# Altium schematic sheet [04] - POWER HARVESTING SYSTEM.SchDoc
size A2; DocumentNumber: 4; SheetNumber: 4; SheetTotal: 12
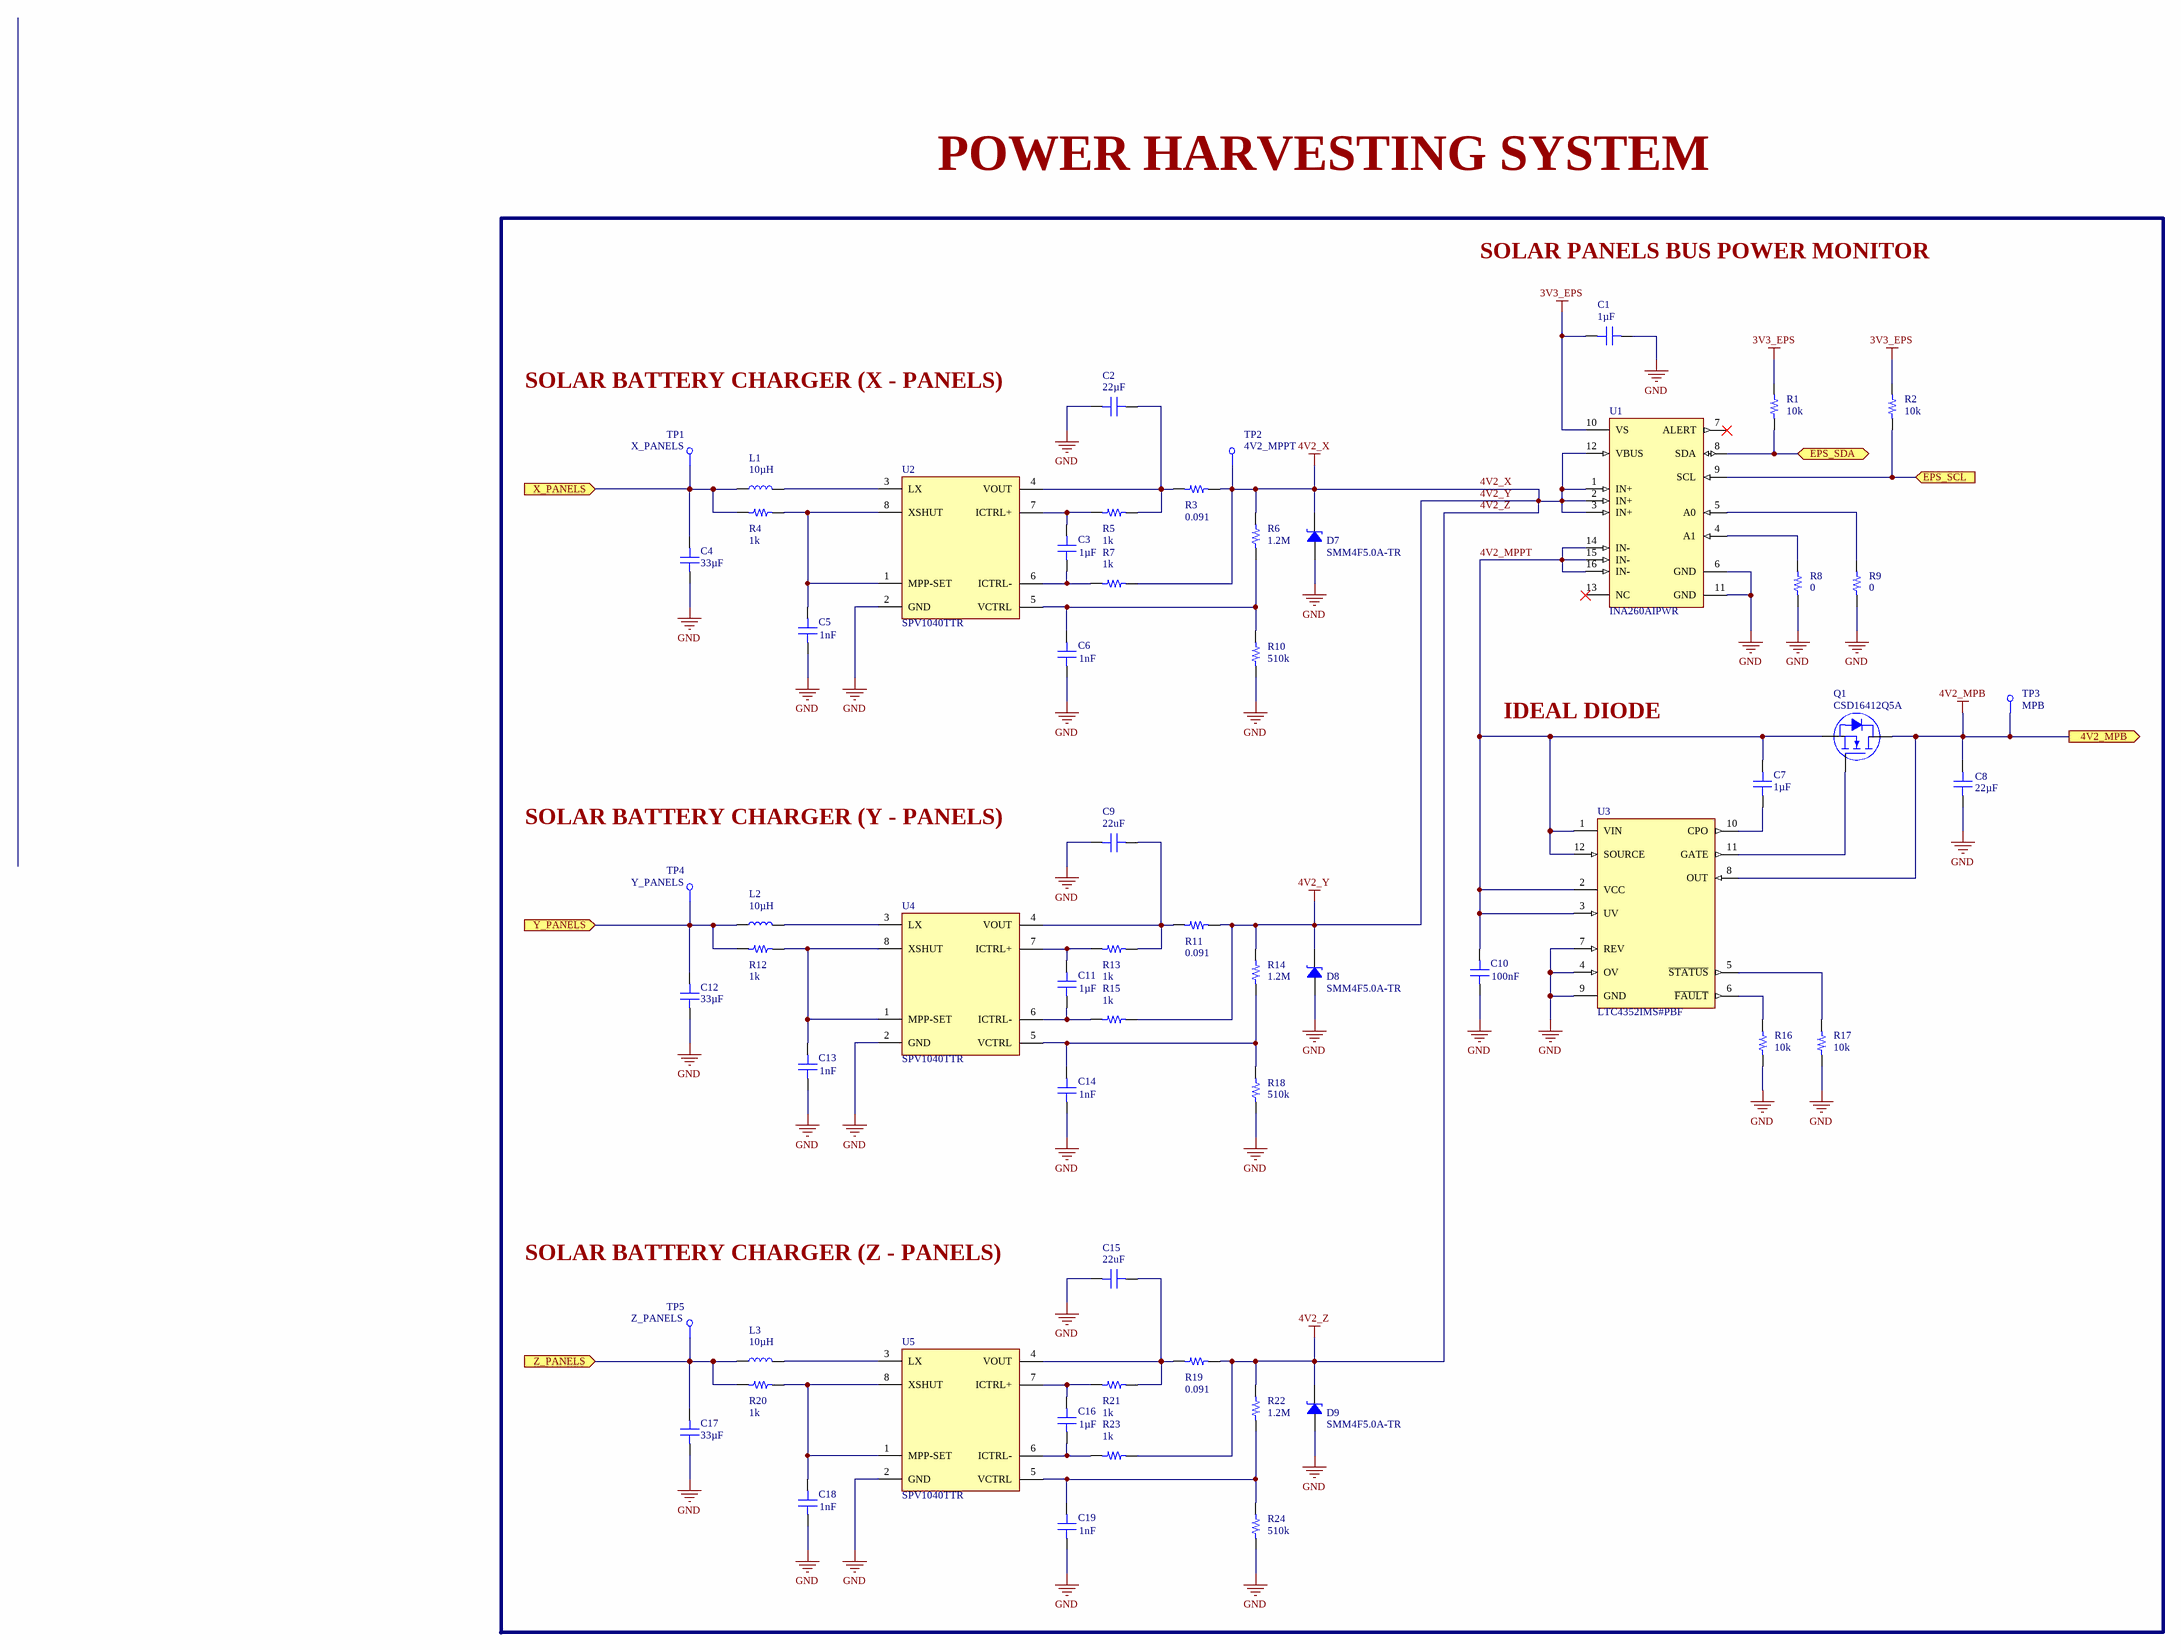
[diagram p0: [04] - POWER HARVESTING SYSTEM.SchDoc]

## Parts
C1  Capacitance: 1µF  [CAP 0603/1608]  (hidden comment: CL10A105KP8NNNC)
C2  Capacitance: 22µF  [CAP 0805/2012]  (hidden comment: CL21A226MQQNNNE)
C3  Capacitance: 1µF  [CAP 0603/1608]  (hidden comment: CL10A105KP8NNNC)
C4  Capacitance: 33µF  [CAP 0805/2012]  (hidden comment: GRM21BR60G336ME15L)
C5  Capacitance: 1nF  [CAP 0603/1608]  (hidden comment: CL10C102JB8NNNC)
C6  Capacitance: 1nF  [CAP 0603/1608]  (hidden comment: CL10C102JB8NNNC)
C7  Capacitance: 1µF  [CAP 0603/1608]  (hidden comment: CL10A105KP8NNNC)
C8  Capacitance: 22µF  [CAP 0603/1608]  (hidden comment: GRM188R60J226MEA0D)
C9  Capacitance: 22uF  [CAP 0805/2012]  (hidden comment: CL21A226MQQNNNE)
C10  Capacitance: 100nF  [CAP 0603/1608]  (hidden comment: C0603C104K8RACTU)
C11  Capacitance: 1µF  [CAP 0603/1608]  (hidden comment: CL10A105KP8NNNC)
C12  Capacitance: 33µF  [CAP 0805/2012]  (hidden comment: GRM21BR60G336ME15L)
C13  Capacitance: 1nF  [CAP 0603/1608]  (hidden comment: CL10C102JB8NNNC)
C14  Capacitance: 1nF  [CAP 0603/1608]  (hidden comment: CL10C102JB8NNNC)
C15  Capacitance: 22uF  [CAP 0805/2012]  (hidden comment: CL21A226MQQNNNE)
C16  Capacitance: 1µF  [CAP 0603/1608]  (hidden comment: CL10A105KP8NNNC)
C17  Capacitance: 33µF  [CAP 0805/2012]  (hidden comment: GRM21BR60G336ME15L)
C18  Capacitance: 1nF  [CAP 0603/1608]  (hidden comment: CL10C102JB8NNNC)
C19  Capacitance: 1nF  [CAP 0603/1608]  (hidden comment: CL10C102JB8NNNC)
D7  SMM4F5.0A-TR  [DO216-AA]
D8  SMM4F5.0A-TR  [DO216-AA]
D9  SMM4F5.0A-TR  [DO216-AA]
L1  Inductance: 10µH  [SRR1206]  (hidden comment: SRR1206-100ML)
L2  Inductance: 10µH  [SRR1206]  (hidden comment: SRR1206-100ML)
L3  Inductance: 10µH  [SRR1206]  (hidden comment: SRR1206-100ML)
Q1  CSD16412Q5A  [8-VSONP (5x6)]
R1  Resistance: 10k  [RES 0603/1608]  (hidden comment: RNCP0603FTD10K0)
R2  Resistance: 10k  [RES 0603/1608]  (hidden comment: RNCP0603FTD10K0)
R3  Resistance: 0.091  [STACKPOLE CSRN2512]  (hidden comment: RLP73N3AR091FTDF)
R4  Resistance: 1k  [RES 0603/1608]  (hidden comment: ESR03EZPJ102)
R5  Resistance: 1k  [RES 0603/1608]  (hidden comment: ESR03EZPJ102)
R6  Resistance: 1.2M  [RES 0603/1608]  (hidden comment: RC0603JR-071M2L)
R7  Resistance: 1k  [RES 0603/1608]  (hidden comment: ESR03EZPJ102)
R8  Resistance: 0  [RES 0603/1608]  (hidden comment: RMCF0603ZT0R00)
R9  Resistance: 0  [RES 0603/1608]  (hidden comment: RMCF0603ZT0R00)
R10  Resistance: 510k  [RES 0603/1608]  (hidden comment: RMCF0603FT510K)
R11  Resistance: 0.091  [STACKPOLE CSRN2512]  (hidden comment: RLP73N3AR091FTDF)
R12  Resistance: 1k  [RES 0603/1608]  (hidden comment: ESR03EZPJ102)
R13  Resistance: 1k  [RES 0603/1608]  (hidden comment: ESR03EZPJ102)
R14  Resistance: 1.2M  [RES 0603/1608]  (hidden comment: RC0603JR-071M2L)
R15  Resistance: 1k  [RES 0603/1608]  (hidden comment: ESR03EZPJ102)
R16  Resistance: 10k  [RES 0603/1608]  (hidden comment: RNCP0603FTD10K0)
R17  Resistance: 10k  [RES 0603/1608]  (hidden comment: RNCP0603FTD10K0)
R18  Resistance: 510k  [RES 0603/1608]  (hidden comment: RMCF0603FT510K)
R19  Resistance: 0.091  [STACKPOLE CSRN2512]  (hidden comment: RLP73N3AR091FTDF)
R20  Resistance: 1k  [RES 0603/1608]  (hidden comment: ESR03EZPJ102)
R21  Resistance: 1k  [RES 0603/1608]  (hidden comment: ESR03EZPJ102)
R22  Resistance: 1.2M  [RES 0603/1608]  (hidden comment: RC0603JR-071M2L)
R23  Resistance: 1k  [RES 0603/1608]  (hidden comment: ESR03EZPJ102)
R24  Resistance: 510k  [RES 0603/1608]  (hidden comment: RMCF0603FT510K)
TP1  X_PANELS  [Testpoint]
TP2  4V2_MPPT  [Testpoint]
TP3  MPB  [Testpoint]
TP4  Y_PANELS  [Testpoint]
TP5  Z_PANELS  [Testpoint]
U1  INA260AIPWR  [TSOP65P640X120-16N]
U2  SPV1040TTR  [TSOP65P630X120-8N]
U3  LTC4352IMS#PBF  [MSOP-12]
U4  SPV1040TTR  [TSOP65P630X120-8N]
U5  SPV1040TTR  [TSOP65P630X120-8N]

## Ports
4V2_MPB (out), EPS_SCL (in), EPS_SDA (bidir), X_PANELS (in), Y_PANELS (in), Z_PANELS (in)

## Nets
3V3_EPS: C1.1 R1.2 R2.2 U1.10(VS)
4V2_MPB: C8.2 Q1.D TP3.1 U3.8(OUT) ; port 4V2_MPB
4V2_X: D7.K D8.K D9.K R3.2 R6.2 R7.2 R11.2 R14.2 R15.2 R19.2 R22.2 R23.2 TP2.1 U1.1(IN+) U1.2(IN+) U1.3(IN+) U1.12(VBUS)  [also labelled 4V2_Y, 4V2_Z]
GND: C1.2 C2.2 C4.1 C5.1 C6.1 C8.1 C9.2 C10.1 C12.1 C13.1 C14.1 C15.2 C17.1 C18.1 C19.1 D7.A D8.A D9.A R8.1 R9.1 R10.1 R16.1 R17.1 R18.1 R24.1 U1.6(GND) U1.11(GND) U2.2(GND) U3.4(OV) U3.7(REV) U3.9(GND) U4.2(GND) U5.2(GND)
4V2_MPPT: C7.2 C10.2 Q1.S U1.14(IN-) U1.15(IN-) U1.16(IN-) U3.1(VIN) U3.2(VCC) U3.3(UV) U3.12(SOURCE)
EPS_SCL: R2.1 U1.9(SCL) ; port EPS_SCL
EPS_SDA: R1.1 U1.8(SDA) ; port EPS_SDA
X_PANELS: C4.2 L1.1 R4.1 TP1.1 ; port X_PANELS
Y_PANELS: C12.2 L2.1 R12.1 TP4.1 ; port Y_PANELS
Z_PANELS: C17.2 L3.1 R20.1 TP5.1 ; port Z_PANELS
NetC2_1: C2.1 R3.1 R5.2 U2.4(VOUT)
NetC3_1: C3.1 R7.1 U2.6(ICTRL-)
NetC3_2: C3.2 R5.1 U2.7(ICTRL+)
NetC5_2: C5.2 R4.2 U2.1(MPP-SET) U2.8(XSHUT)
NetC6_2: C6.2 R6.1 R10.2 U2.5(VCTRL)
NetC7_1: C7.1 U3.10(CPO)
NetC9_1: C9.1 R11.1 R13.2 U4.4(VOUT)
NetC11_1: C11.1 R15.1 U4.6(ICTRL-)
NetC11_2: C11.2 R13.1 U4.7(ICTRL+)
NetC13_2: C13.2 R12.2 U4.1(MPP-SET) U4.8(XSHUT)
NetC14_2: C14.2 R14.1 R18.2 U4.5(VCTRL)
NetC15_1: C15.1 R19.1 R21.2 U5.4(VOUT)
NetC16_1: C16.1 R23.1 U5.6(ICTRL-)
NetC16_2: C16.2 R21.1 U5.7(ICTRL+)
NetC18_2: C18.2 R20.2 U5.1(MPP-SET) U5.8(XSHUT)
NetC19_2: C19.2 R22.1 R24.2 U5.5(VCTRL)
NetL1_2: L1.2 U2.3(LX)
NetL2_2: L2.2 U4.3(LX)
NetL3_2: L3.2 U5.3(LX)
NetQ1_G: Q1.G U3.11(GATE)
NetR8_2: R8.2 U1.4(A1)
NetR9_2: R9.2 U1.5(A0)
NetR16_2: R16.2 U3.6(~{FAULT})
NetR17_2: R17.2 U3.5(~{STATUS})

Not connected (* = marked no-connect by the designer): U1 7(ALERT)* 13(NC)*

## Notes on the sheet
- POWER HARVESTING SYSTEM
- SOLAR PANELS BUS POWER MONITOR
- SOLAR BATTERY CHARGER (X - PANELS)
- IDEAL DIODE
- SOLAR BATTERY CHARGER (Y - PANELS)
- SOLAR BATTERY CHARGER (Z - PANELS)
- Project:
- Page Contents:
- Size:
- Revision:
- A2
- Document Number:
- Design:
- Date:
- Sheet
- of

## Library data of the parts
C1 C3 C7 C11 C16 = CL10A105KP8NNNC: CAP CER 1UF 10V X5R 0603; Manufacturer: Samsung; Tolerance: 10%; Supplier 1: Digi-Key; Manufacturer Part Number: CL10A105KP8NNNC; Stock 1: 4411775; Pricing 1: 1 = 0.10000, 10 = 0.03800, 100 = 0.01680, 500 = 0.01200, 1000 = 0.00943 (USD); RoHS: Yes; Mount: Surface Mount; Case/Package: 0603; Case Code (Metric): 1608; Case Code (Imperial): 0603; Contact Plating: Tin; Min Operating Temperature: -55°C; Max Operating Temperature: 85°C; Packaging: Tape and Reel; Package Quantity: 1; Voltage Rating: 10V; Dielectric: X5R; Voltage: 10V; Length: 1.6mm; Height: 0.8mm; Width: 0.031inch; Thickness: 0.035inch; Depth: 0.8mm; Radiation Hardening: No; ComponentLink1URL: https://datasheet.ciiva.com/15195/getdatasheetpartid-358616-15195708.pdf?src-supplier=Verical; ComponentLink1Description: https://datasheet.ciiva.com/15195/getdatasheetpartid-358616-15195708.pdf?src-supplier=Verical; ComponentLink2URL: https://datasheet.ciiva.com/16358/cl05b104kq5nnnc-16358431.pdf?src-supplier=Future+Electronics; ComponentLink2Description: https://datasheet.ciiva.com/16358/cl05b104kq5nnnc-16358431.pdf?src-supplier=Future+Electronics; Supplier Part Number 1: 1276-1182-1-ND
C2 C9 C15 = CL21A226MQQNNNE: CAP CER 22UF 6.3V X5R 0805; Manufacturer: Samsung; Tolerance: 20%; Supplier 1: Digi-Key; Manufacturer Part Number: CL21A226MQQNNNE; Stock 1: 20000; Pricing 1: 1=0.22, 10=0.152, 100=0.0768, 500=0.05256, 1000=0.04649 (USD); Mount: Surface Mount; Case/Package: 0805; Contact Plating: Tin; Case Code (Metric): 2012; Case Code (Imperial): 0805; Min Operating Temperature: -55°C; Max Operating Temperature: 85°C; Package Quantity: 2000; Packaging: Tape and Reel; Voltage Rating: 6.3V; Dielectric: X5R; Voltage Rating (DC): 6.3V; Length: 2mm; Height: 1.25mm; Width: 0.049inch; Thickness: 0.055inch; Depth: 1.25mm; Radiation Hardening: No; Lead Free: Lead Free; ComponentLink1URL: https://datasheet.ciiva.com/25796/cl21a226mqqnnne-25796195.pdf; ComponentLink1Description: https://datasheet.ciiva.com/25796/cl21a226mqqnnne-25796195.pdf; ComponentLink2URL: https://datasheet.ciiva.com/26838/getdatasheetpartid-357607-26838611.pdf; ComponentLink2Description: https://datasheet.ciiva.com/26838/getdatasheetpartid-357607-26838611.pdf; ComponentLink3URL: https://datasheet.ciiva.com/16361/cl21a226mqqnnne-16361189.pdf; ComponentLink3Description: https://datasheet.ciiva.com/16361/cl21a226mqqnnne-16361189.pdf; ComponentLink4URL: https://datasheet.ciiva.com/26787/cl21a226mqqnnne-26787006.pdf; ComponentLink4Description: https://datasheet.ciiva.com/26787/cl21a226mqqnnne-26787006.pdf; Supplier Part Number 1: 1276-1100-6-ND
C4 C12 C17 = GRM21BR60G336ME15L: CAP CER 33UF 4V X5R 0805; Manufacturer: Murata; Tolerance: 20%; Supplier 1: Digi-Key; Manufacturer Part Number: GRM21BR60G336ME15L; Stock 1: 3473; Pricing 1: 1=0.92, 10=0.699, 100=0.5, 500=0.3871, 1000=0.33333 (USD); Case/Package: 0805; Min Operating Temperature: -55°C; Max Operating Temperature: 125°C; Packaging: Tape and Reel; Dielectric: X5R; Voltage Rating (DC): 4V; Length: 2mm; Depth: 1.25mm; Width: 1.25mm; Thickness: 1.25mm; Supplier Part Number 1: 490-16621-1-ND
C5 C6 C13 C14 C18 C19 = CL10C102JB8NNNC: CAP CER 1000PF 50V C0G/NP0 0603; Manufacturer: Samsung; Material: Ceramic; Tolerance: 5%; Dielectric: C0G; Temperature Coefficient: 300ppm/°C; Supplier 1: Digi-Key; Manufacturer Part Number: CL10C102JB8NNNC; Stock 1: 2851554; Pricing 1: 1=0.1, 10=0.057, 100=0.0253, 500=0.0181, 1000=0.01422 (USD); Mount: Surface Mount; Case/Package: 0603; Case Code (Metric): 1608; Case Code (Imperial): 0603; Min Operating Temperature: -55°C; Max Operating Temperature: 125°C; Packaging: Tape and Reel; Package Quantity: 1; Voltage Rating: 50V; Voltage: 50V; Voltage Rating (DC): 50V; Length: 1.6mm; Height: 0.8mm; Depth: 0.8mm; Width: 0.031inch; Thickness: 0.035inch; Radiation Hardening: No; Lead Free: Lead Free; ComponentLink1URL: https://www.distrelec.biz/Web/Downloads/_e/ng/MLCC_CatalogDownload2013_ENG.pdf?mime=application%2Fpdf&src-supplier=Distrelec; ComponentLink1Description: https://www.distrelec.biz/Web/Downloads/_e/ng/MLCC_CatalogDownload2013_ENG.pdf?mime=application%2Fpdf&src-supplier=Distrelec; ComponentLink2URL: https://www.verical.com/server-webapp/html/getDatasheet?partID=354056&src-supplier=Verical; ComponentLink2Description: https://www.verical.com/server-webapp/html/getDatasheet?partID=354056&src-supplier=Verical; ComponentLink3URL: https://produktinfo.conrad.com/datenblaetter/450000-474999/458273-da-01-en-VS_KONDENSATOR_0603.pdf?src-supplier=Conrad; ComponentLink3Description: https://produktinfo.conrad.com/datenblaetter/450000-474999/458273-da-01-en-VS_KONDENSATOR_0603.pdf?src-supplier=Conrad; Supplier Part Number 1: 1276-1091-1-ND
C8 = GRM188R60J226MEA0D: CAP CER 22UF 6.3V X5R 0603; Manufacturer: Murata; Tolerance: 20%; Supplier 1: Digi-Key; Manufacturer Part Number: GRM188R60J226MEA0D; Stock 1: 6592419; Pricing 1: 1 = 0.26000, 10 = 0.17700, 100 = 0.10010, 500 = 0.07066, 1000 = 0.06182 (USD); RoHS: Yes; Mount: Surface Mount; Case/Package: 0603; Weight: 0.000222oz; Case Code (Metric): 1608; Case Code (Imperial): 0603; Min Operating Temperature: -55°C; Max Operating Temperature: 85°C; Packaging: Tape and Reel; Package Quantity: 4000; Voltage Rating: 6.3V; Dielectric: X5R; Termination: SMD/SMT; Voltage Rating (DC): 6.3V; Length: 1.6mm; Height: 0.8mm; Width: 0.8mm; Thickness: 0.039inch; Depth: 0.8mm; REACH SVHC: No SVHC; Lead Free: Lead Free; ComponentLink1URL: https://datasheet.ciiva.com/29540/partnumbering-e-01-29540441.pdf?src-supplier=Digi-Key; ComponentLink1Description: https://datasheet.ciiva.com/29540/partnumbering-e-01-29540441.pdf?src-supplier=Digi-Key; ComponentLink2URL: https://datasheet.ciiva.com/29540/partnumbering-e-01-29540442.pdf?src-supplier=Digi-Key; ComponentLink2Description: https://datasheet.ciiva.com/29540/partnumbering-e-01-29540442.pdf?src-supplier=Digi-Key; ComponentLink3URL: https://datasheet.ciiva.com/29540/partnumbering-e-01-29540443.pdf?src-supplier=Digi-Key; ComponentLink3Description: https://datasheet.ciiva.com/29540/partnumbering-e-01-29540443.pdf?src-supplier=Digi-Key; Supplier Part Number 1: 490-7611-1-ND
C10 = C0603C104K8RACTU: CAP CER 0.1UF 10V X7R 0603; Manufacturer: KEMET; Dielectric Material: Ceramic; Tolerance: 10%; Dissipation Factor: 5%; Supplier 1: Digi-Key; Manufacturer Part Number: C0603C104K8RACTU; Stock 1: 778651; Pricing 1: 1=0.15, 10=0.107, 100=0.0504, 500=0.03536, 1000=0.02927 (USD); Mount: Surface Mount,PCB; Case/Package: 0603; Number of Pins: 2; Case Code (Imperial): 0603; Case Code (Metric): 1608; Contact Plating: Tin,Matte; Min Operating Temperature: -55°C; Max Operating Temperature: 125°C; Voltage Rating: 10V; Packaging: Tape and Reel; Package Quantity: 1; Voltage Rating (DC): 10V; Dielectric: X7R; Termination: SMD/SMT; Voltage: 10V; Length: 1.6mm; Height: 0.8mm; Width: 0.8mm; Lead Pitch: 0.7mm; Thickness: 0.034inch; Depth: 0.8mm; Radiation Hardening: No; REACH SVHC: No SVHC; ComponentLink1URL: http://www.farnell.com/datasheets/2315110.pdf?src-supplier=Farnell; ComponentLink1Description: http://www.farnell.com/datasheets/2315110.pdf?src-supplier=Farnell; ComponentLink2URL: http://www.kemet.com/kemet/web/homepage/kechome.nsf/vapubfiles/KEM_C1002_X7R_SMD.pdf/$file/KEM_C1002_X7R_SMD.pdf?src-supplier=Element14; ComponentLink2Description: http://www.kemet.com/kemet/web/homepage/kechome.nsf/vapubfiles/KEM_C1002_X7R_SMD.pdf/$file/KEM_C1002_X7R_SMD.pdf?src-supplier=Element14; ComponentLink3URL: https://www.verical.com/server-webapp/html/getDatasheet?partID=91529&src-supplier=Verical; ComponentLink3Description: https://www.verical.com/server-webapp/html/getDatasheet?partID=91529&src-supplier=Verical; ComponentLink4URL: http://www.mouser.com/ds/2/212/KEM_C1002_X7R_SMD-1102033.pdf?src-supplier=Mouser; ComponentLink4Description: http://www.mouser.com/ds/2/212/KEM_C1002_X7R_SMD-1102033.pdf?src-supplier=Mouser; ComponentLink5URL: http://www.alliedelec.com/m/d/9bfe7773041ffe9d406e68bc7b377fdd.pdf?src-supplier=Allied+Electronics; ComponentLink5Description: http://www.alliedelec.com/m/d/9bfe7773041ffe9d406e68bc7b377fdd.pdf?src-supplier=Allied+Electronics; ComponentLink6URL: http://www.farnell.com/datasheets/1851736.pdf?src-supplier=Element14; ComponentLink6Description: http://www.farnell.com/datasheets/1851736.pdf?src-supplier=Element14; Supplier Part Number 1: 399-1095-1-ND
D7-D9 = SMM4F5.0A-TR: Diode TVS Single Uni-Dir 5V 400W 2-Pin DO-222AA T/R; Manufacturer: STMicroelectronics; Direction: Unidirectional; Reverse Breakdown Voltage: 6.46V; Max Surge Current: 174A; Number of Channels: 1; Clamping Voltage: 13.4V; Power Line Protection: No; Test Current: 10mA; Max Reverse Leakage Current: 10uA; Supplier 1: Digi-Key; Manufacturer Part Number: SMM4F5.0A-TR; Stock 1: 10565; Pricing 1: 1=0.6, 10=0.511, 100=0.3816, 500=0.2998, 1000=0.23166 (USD); Mount: Surface Mount; Number of Pins: 2; Min Operating Temperature: -55°C; Max Operating Temperature: 175°C; Packaging: Tape and Reel; Operating Supply Voltage: 5V; Package Quantity: 12000; Polarity: Unidirectional; Breakdown Voltage: 6.46V; Peak Pulse Power: 400W; Termination: SMD/SMT; Number of Unidirectional Channels: 1; Reverse Standoff Voltage: 5V; Min Breakdown Voltage: 6.46V; Number of Elements: 1; Peak Pulse Current: 174A; Element Configuration: Single; Max Power Dissipation: 400W; Leakage Current: 10uA; Composition: Zener; Radiation Hardening: No; ComponentLink1URL: http://www.mouser.com/ds/2/389/CD00178940-251527.pdf?src-supplier=Mouser; ComponentLink1Description: http://www.mouser.com/ds/2/389/CD00178940-251527.pdf?src-supplier=Mouser; ComponentLink2URL: http://www.st.com/web/en/resource/technical/document/datasheet/CD00178940.pdf?src-supplier=Digi-Key; ComponentLink2Description: http://www.st.com/web/en/resource/technical/document/datasheet/CD00178940.pdf?src-supplier=Digi-Key; ComponentLink3URL: http://www.st.com/web/en/resource/technical/document/datasheet/CD00178940.pdf?src-supplier=Avnet+Europe; ComponentLink3Description: http://www.st.com/web/en/resource/technical/document/datasheet/CD00178940.pdf?src-supplier=Avnet+Europe; Supplier Part Number 1: 497-15660-1-ND
L1-L3 = SRR1206-100ML: FIXED IND 10UH 3.3A 35 MOHM SMD; Manufacturer: Bourns; Core Material: Ferrite; Material: Steel; Q Factor: 18; Self Resonant Frequency: 18MHz; Shielding: Shielded; Tolerance: 20%; Saturation Current: 5.7A; Resistance: 35MR; Test Frequency: 1kHz; Supplier 1: Digi-Key; Manufacturer Part Number: SRR1206-100ML; Stock 1: 4095; Pricing 1: 1=1.13, 10=1.047, 100=0.7567 (USD); Mount: Surface Mount; Case/Package: Nonstandard; Number of Pins: 12; Min Operating Temperature: -40°C; Max Operating Temperature: 125°C; Packaging: Tape and Reel; Inductance Tolerance: 20%; Package Quantity: 600; Current Rating: 3.3A; Frequency: 18MHz; Composition: Wirewound; DC Resistance (DCR): 35mR; Max DC Current: 3.3A; Termination: SMD/SMT; DC Current: 3.3A; Military Standard: Not; RMS Current (Irms): 3.3A; Length: 12.7mm; Height: 6.5mm; Width: 12.7mm; Height - Seated (Max): 0.256inch; Depth: 13mm; Radiation Hardening: No; REACH SVHC: No SVHC; ComponentLink1URL: http://www.bourns.com/pdfs/SRR1206.pdf?src-supplier=Avnet+Europe; ComponentLink1Description: http://www.bourns.com/pdfs/SRR1206.pdf?src-supplier=Avnet+Europe; ComponentLink2URL: http://www.bourns.com/docs/Product-Datasheets/SRR1206.pdf?src-supplier=Digi-Key; ComponentLink2Description: http://www.bourns.com/docs/Product-Datasheets/SRR1206.pdf?src-supplier=Digi-Key; ComponentLink3URL: https://www.bourns.com/docs/Product-Datasheets/SRR1206.pdf?src-supplier=Digi-Key; ComponentLink3Description: https://www.bourns.com/docs/Product-Datasheets/SRR1206.pdf?src-supplier=Digi-Key; ComponentLink4URL: http://www.bourns.com/pdfs/SRR1206.pdf?src-supplier=Avnet; ComponentLink4Description: http://www.bourns.com/pdfs/SRR1206.pdf?src-supplier=Avnet; ComponentLink5URL: http://www.farnell.com/datasheets/1914018.pdf?src-supplier=Element14; ComponentLink5Description: http://www.farnell.com/datasheets/1914018.pdf?src-supplier=Element14; Supplier Part Number 1: SRR1206-100MLCT-ND
Q1 = CSD16412Q5A: MOSFET N-CH 25V 52A 8SON; Manufacturer: Texas Instruments; Rds On Max: 11mR; Input Capacitance: 530pF; Rise Time: 7.1ns; Nominal Vgs: 2V; Max Power Dissipation: 3W; Fall Time: 3.3ns; Drain to Source Resistance: 9mR; Turn-Off Delay Time: 5.7ns; Gate to Source Voltage (Vgs): 16V; Turn-On Delay Time: 5.5ns; Number of Elements: 1; Element Configuration: Single; Supplier 1: Digi-Key; Manufacturer Part Number: CSD16412Q5A; Stock 1: 7977; Pricing 1: 1 = 1.00000, 10 = 0.87200, 100 = 0.67300, 500 = 0.49852, 1000 = 0.39882 (USD); RoHS: Yes; Mount: Surface Mount; Case/Package: QFN; Number of Pins: 8; Contact Plating: Tin; Min Operating Temperature: -55°C; Max Operating Temperature: 150°C; Package Quantity: 1; Packaging: Tape and Reel; Dual Supply Voltage: 25V; Drain to Source Voltage (Vdss): 25V; Continuous Drain Current (ID): 52A; Drain to Source Breakdown Voltage: 25V; Power Dissipation: 3W; Threshold Voltage: 2V; Termination: SMD/SMT; Length: 5.8mm; Height: 1.1mm; Width: 5mm; Radiation Hardening: No; REACH SVHC: No SVHC; Lead Free: Contains Lead; ComponentLink1URL: https://datasheet.ciiva.com/6387/csd16412q5a-6387536.pdf?src-supplier=Digi-Key; ComponentLink1Description: https://datasheet.ciiva.com/6387/csd16412q5a-6387536.pdf?src-supplier=Digi-Key; ComponentLink2URL: https://datasheet.ciiva.com/14423/slps207a-14423489.pdf?src-supplier=Avnet; ComponentLink2Description: https://datasheet.ciiva.com/14423/slps207a-14423489.pdf?src-supplier=Avnet; ComponentLink3URL: https://datasheet.ciiva.com/1255/csd16412q5a-1255298.pdf?src-supplier=Newark; ComponentLink3Description: https://datasheet.ciiva.com/1255/csd16412q5a-1255298.pdf?src-supplier=Newark; ComponentLink4URL: https://datasheet.ciiva.com/4438/slps207a-122183-4438713.pdf?src-supplier=Mouser; ComponentLink4Description: https://datasheet.ciiva.com/4438/slps207a-122183-4438713.pdf?src-supplier=Mouser; ComponentLink5URL: https://datasheet.ciiva.com/5751/483980-5751769.pdf?src-supplier=Farnell; ComponentLink5Description: https://datasheet.ciiva.com/5751/483980-5751769.pdf?src-supplier=Farnell; ComponentLink6URL: https://datasheet.ciiva.com/6387/csd16412q5a-6387530.pdf?src-supplier=Digi-Key; ComponentLink6Description: https://datasheet.ciiva.com/6387/csd16412q5a-6387530.pdf?src-supplier=Digi-Key; ComponentLink7URL: https://datasheet.ciiva.com/14192/slps207a-14192890.pdf?src-supplier=Avnet; ComponentLink7Description: https://datasheet.ciiva.com/14192/slps207a-14192890.pdf?src-supplier=Avnet; ComponentLink8URL: https://datasheet.ciiva.com/6387/csd16412q5a-6387532.pdf?src-supplier=Digi-Key; ComponentLink8Description: https://datasheet.ciiva.com/6387/csd16412q5a-6387532.pdf?src-supplier=Digi-Key; Supplier Part Number 1: 296-24256-1-ND
R1 R2 R16 R17 = RNCP0603FTD10K0: RES SMD 10K OHM 1% 1/8W 0603; Manufacturer: Stackpole Electronics; Max Power Dissipation: 125mW; Temperature Coefficient: 100ppm/°C; Supplier 1: Digi-Key; Manufacturer Part Number: RNCP0603FTD10K0; Stock 1: 579582; Pricing 1: 1 = 0.10000, 10 = 0.06700, 100 = 0.02730, 1000 = 0.01224, 2500 = 0.01063 (USD); RoHS: Yes; Mount: Surface Mount; Case/Package: 0603; Case Code (Metric): 1608; Case Code (Imperial): 0603; Contact Plating: Tin; Min Operating Temperature: -55°C; Max Operating Temperature: 155°C; Packaging: Tape and Reel; Tolerance: 1%; Composition: Thin Film; Number of Terminations: 2; Features: Moisture Resistant; Length: 0.059inch; Height: 0.02inch; Width: 0.031inch; Radiation Hardening: No; Lead Free: Lead Free; ComponentLink1URL: https://www.seielect.com/Catalog/SEI-rncp.pdf?src-supplier=Avnet; ComponentLink1Description: https://www.seielect.com/Catalog/SEI-rncp.pdf?src-supplier=Avnet; ComponentLink2URL: https://www.seielect.com/catalog/SEI-Packaging.pdf?src-supplier=Digi-Key; ComponentLink2Description: https://www.seielect.com/catalog/SEI-Packaging.pdf?src-supplier=Digi-Key; ComponentLink3URL: https://www.seielect.com/Catalog/SEI-rncp.pdf?src-supplier=Digi-Key; ComponentLink3Description: https://www.seielect.com/Catalog/SEI-rncp.pdf?src-supplier=Digi-Key; Supplier Part Number 1: RNCP0603FTD10K0CT-ND
R3 R11 R19 = RLP73N3AR091FTDF: RES SMD 0.091 OHM 1% 2W 2512; Manufacturer: TE Connectivity; Manufacturer Part Number: 2-2176057-4; Temperature Coefficient: 300ppm/°C; Supplier 1: Digi-Key; Stock 1: 2342; Pricing 1: 1=0.75, 10=0.629, 25=0.5392, 50=0.4852, 100=0.4224, 250=0.37744, 500=0.30554 (USD); Case/Package: 2512; Case Code (Metric): 6432; Case Code (Imperial): 2512; Min Operating Temperature: -55°C; Max Operating Temperature: 155°C; Packaging: Tape and Reel; Tolerance: 1%; Composition: Thick Film; Number of Terminations: 2; Package Quantity: 1000; Max Power Dissipation: 2W; Length: 0.25inch; Height: 0.033inch; Width: 0.124inch; ComponentLink1URL: http://www.te.com/commerce/DocumentDelivery/DDEController?Action=srchrtrv&DocNm=2176057&DocType=Customer+Drawing&DocLang=English&src-supplier=Digi-Key; ComponentLink1Description: http://www.te.com/commerce/DocumentDelivery/DDEController?Action=srchrtrv&DocNm=2176057&DocType=Customer+Drawing&DocLang=English&src-supplier=Digi-Key; Supplier Part Number 1: A109693CT-ND
R4 R5 R7 R12 R13 R15 R20 R21 R23 = ESR03EZPJ102: RES SMD 1K OHM 5% 1/4W 0603; Manufacturer: Rohm; Temperature Coefficient: 200ppm/°C; Max Power Dissipation: 250mW; Supplier 1: Digi-Key; Manufacturer Part Number: ESR03EZPJ102; Stock 1: 187581; Pricing 1: 1 = 0.10000, 10 = 0.08300, 100 = 0.03180, 1000 = 0.01398, 2500 = 0.01207 (USD); RoHS: Yes; Case/Package: 0603; Case Code (Metric): 1608; Case Code (Imperial): 0603; Min Operating Temperature: -55°C; Max Operating Temperature: 155°C; Tolerance: 5%; Package Quantity: 1; Packaging: Tape and Reel; Composition: Thick Film; Number of Terminations: 2; Features: Automotive AEC-Q200; Length: 0.063inch; Height: 0.022inch; Width: 0.031inch; Lead Free: Lead Free; ComponentLink1URL: https://datasheet.ciiva.com/2469/esr-2469603.pdf?src-supplier=Digi-Key; ComponentLink1Description: https://datasheet.ciiva.com/2469/esr-2469603.pdf?src-supplier=Digi-Key; ComponentLink2URL: https://datasheet.ciiva.com/2469/esr-2469604.pdf?src-supplier=Digi-Key; ComponentLink2Description: https://datasheet.ciiva.com/2469/esr-2469604.pdf?src-supplier=Digi-Key; ComponentLink3URL: https://datasheet.ciiva.com/2469/esr-2469605.pdf?src-supplier=Digi-Key; ComponentLink3Description: https://datasheet.ciiva.com/2469/esr-2469605.pdf?src-supplier=Digi-Key; Supplier Part Number 1: RHM1.0KDCT-ND
R6 R14 R22 = RC0603JR-071M2L: RES SMD 1.2M OHM 5% 1/10W 0603; Manufacturer: Yageo; Temperature Coefficient: 100ppm/°C; Voltage Rating (DC): 50V; Power Rating: 100mW; Supplier 1: Digi-Key; Manufacturer Part Number: RC0603JR-071M2L; Stock 1: 292684; Pricing 1: 1 = 0.10000, 10 = 0.02000, 100 = 0.00810, 1000 = 0.00362, 2500 = 0.00314 (USD); RoHS: Yes; Case/Package: 0603; Contact Plating: Tin; Case Code (Imperial): 0603; Case Code (Metric): 1608; Min Operating Temperature: -55°C; Max Operating Temperature: 155°C; Packaging: Tape and Reel; Tolerance: 5%; Composition: Thick Film; Package Quantity: 5000; Voltage Rating: 50V; Termination: SMD/SMT; Military Standard: Not; Length: 1.6mm; Height: 0.45mm; Width: 0.8mm; Depth: 0.8mm; Radiation Hardening: No; Lead Free: Lead Free; ComponentLink1URL: http://www.mouser.com/ds/2/447/RC0603-272842.pdf?src-supplier=Mouser; ComponentLink1Description: http://www.mouser.com/ds/2/447/RC0603-272842.pdf?src-supplier=Mouser; ComponentLink2URL: http://components.arrow.com/part/dataview/0323_03542222?src-supplier=Arrow+Europe; ComponentLink2Description: http://components.arrow.com/part/dataview/0323_03542222?src-supplier=Arrow+Europe; ComponentLink3URL: http://www.yageo.com/documents/recent/PYu-RC_Group_51_RoHS_L_9.pdf?src-supplier=Digi-Key; ComponentLink3Description: http://www.yageo.com/documents/recent/PYu-RC_Group_51_RoHS_L_9.pdf?src-supplier=Digi-Key; ComponentLink4URL: http://www.yageo.com/documents/recent/PYu-RC0603_51_RoHS_L_5.pdf?src-supplier=Avnet+Europe; ComponentLink4Description: http://www.yageo.com/documents/recent/PYu-RC0603_51_RoHS_L_5.pdf?src-supplier=Avnet+Europe; ComponentLink5URL: http://www.yageo.com/documents/recent/PYu-RC_Group_51_RoHS_L_10.pdf?src-supplier=Digi-Key; ComponentLink5Description: http://www.yageo.com/documents/recent/PYu-RC_Group_51_RoHS_L_10.pdf?src-supplier=Digi-Key; ComponentLink6URL: http://www.yageo.com/documents/recent/PYu-RC_Group_51_RoHS_L_2.pdf?src-supplier=Avnet; ComponentLink6Description: http://www.yageo.com/documents/recent/PYu-RC_Group_51_RoHS_L_2.pdf?src-supplier=Avnet; ComponentLink7URL: http://www.yageo.com/documents/recent/PYu-RC0603_51_RoHS_L_7.pdf?src-supplier=Future+Electronics; ComponentLink7Description: http://www.yageo.com/documents/recent/PYu-RC0603_51_RoHS_L_7.pdf?src-supplier=Future+Electronics; Supplier Part Number 1: 311-1.2MGRCT-ND
R8 R9 = RMCF0603ZT0R00: RES SMD 0 OHM JUMPER 1/10W 0603; Manufacturer: Stackpole Electronics; Power Rating: 100mW; Current Rating: 1A; Working Voltage: 75V; Supplier 1: Digi-Key; Manufacturer Part Number: RMCF0603ZT0R00; Stock 1: 3031399; Pricing 1: 1 = 0.10000, 10 = 0.01600, 25 = 0.01160, 50 = 0.00880, 100 = 0.00640, 250 = 0.00492, 500 = 0.00392, 1000 = 0.00289 (USD); RoHS: Yes; Mount: Surface Mount; Case/Package: 0603; Case Code (Metric): 1608; Case Code (Imperial): 0603; Contact Plating: Tin; Min Operating Temperature: -55°C; Max Operating Temperature: 155°C; Packaging: Tape and Reel; Composition: Thick Film; Number of Terminations: 2; Military Standard: Not; Max Power Dissipation: 100mW; Features: Automotive AEC-Q200; Length: 1.55mm; Height: 0.022inch; Width: 0.031inch; Depth: 0.8mm; Radiation Hardening: No; Lead Free: Lead Free; ComponentLink1URL: https://www.seielect.com/catalog/SEI-Packaging.pdf?src-supplier=Avnet; ComponentLink1Description: https://www.seielect.com/catalog/SEI-Packaging.pdf?src-supplier=Avnet; ComponentLink2URL: https://www.seielect.com/catalog/SEI-Packaging.pdf?src-supplier=Verical; ComponentLink2Description: https://www.seielect.com/catalog/SEI-Packaging.pdf?src-supplier=Verical; ComponentLink3URL: https://www.seielect.com/catalog/SEI-Packaging.pdf?src-supplier=Arrow; ComponentLink3Description: https://www.seielect.com/catalog/SEI-Packaging.pdf?src-supplier=Arrow; ComponentLink4URL: https://www.seielect.com/catalog/SEI-Packaging.pdf?src-supplier=Digi-Key; ComponentLink4Description: https://www.seielect.com/catalog/SEI-Packaging.pdf?src-supplier=Digi-Key; ComponentLink5URL: https://www.seielect.com/Catalog/SEI-RMCF_RMCP.pdf?src-supplier=Digi-Key; ComponentLink5Description: https://www.seielect.com/Catalog/SEI-RMCF_RMCP.pdf?src-supplier=Digi-Key; ComponentLink6URL: https://www.seielect.com/catalog/SEI-Packaging.pdf?src-supplier=Future+Electronics; ComponentLink6Description: https://www.seielect.com/catalog/SEI-Packaging.pdf?src-supplier=Future+Electronics; Supplier Part Number 1: RMCF0603ZT0R00CT-ND
R10 R18 R24 = RMCF0603FT510K: RES SMD 510K OHM 1% 1/10W 0603; Manufacturer: Stackpole Electronics; Max Power Dissipation: 100mW; Temperature Coefficient: 100ppm/°C; Supplier 1: Digi-Key; Manufacturer Part Number: RMCF0603FT510K; Stock 1: 59350; Pricing 1: 1 = 0.10000, 10 = 0.01700, 100 = 0.00680, 1000 = 0.00306, 2500 = 0.00266 (USD); RoHS: Yes; Mount: Surface Mount; Case/Package: 0603; Case Code (Metric): 1608; Case Code (Imperial): 0603; Contact Plating: Tin; Min Operating Temperature: -55°C; Max Operating Temperature: 155°C; Package Quantity: 5000; Packaging: Tape and Reel; Tolerance: 1%; Composition: Thick Film; Number of Terminations: 2; Features: Automotive AEC-Q200; Length: 0.061inch; Height: 0.022inch; Width: 0.031inch; Radiation Hardening: No; Lead Free: Lead Free; ComponentLink1URL: https://www.seielect.com/catalog/SEI-Packaging.pdf?src-supplier=Digi-Key; ComponentLink1Description: https://www.seielect.com/catalog/SEI-Packaging.pdf?src-supplier=Digi-Key; ComponentLink2URL: https://www.seielect.com/Catalog/SEI-RMCF_RMCP.pdf?src-supplier=Digi-Key; ComponentLink2Description: https://www.seielect.com/Catalog/SEI-RMCF_RMCP.pdf?src-supplier=Digi-Key; ComponentLink3URL: http://www.seielect.com/Catalog/SEI-RMCF_RMCP.pdf?src-supplier=Digi-Key; ComponentLink3Description: http://www.seielect.com/Catalog/SEI-RMCF_RMCP.pdf?src-supplier=Digi-Key; ComponentLink4URL: https://www.seielect.com/catalog/SEI-RMCF_RMCP.pdf?src-supplier=Avnet; ComponentLink4Description: https://www.seielect.com/catalog/SEI-RMCF_RMCP.pdf?src-supplier=Avnet; Supplier Part Number 1: RMCF0603FT510KCT-ND
TP1-TP5 = Testpoint: GENERIC TESTPOINT
U1 = INA260AIPWR: IC MONITOR PWR/CURR 16TSSOP; Manufacturer: Texas Instruments; Accuracy: 0.02%; Output Current: 10mA; Supplier 1: Digi-Key; Manufacturer Part Number: INA260AIPWR; Stock 1: 4446; Pricing 1: 1=4.54, 10=4.077, 100=3.3401, 500=2.8434, 1000=2.39805 (USD); Mount: Surface Mount; Case/Package: TSSOP; Number of Pins: 16; Min Operating Temperature: -40°C; Max Operating Temperature: 125°C; Packaging: Tape and Reel; Supplier Part Number 1: 296-47777-1-ND
U2 U4 U5 = SPV1040TTR: IC SOLAR BATTERY CHARGER 8TSSOP; Manufacturer: STMicroelectronics; Output Voltage: 5.2V; Min Supply Voltage: 300mV; Max Supply Voltage: 5.5V; Number of Channels: 2; Supplier 1: Digi-Key; Manufacturer Part Number: SPV1040TTR; Stock 1: 8278; Pricing 1: 1=3.25, 10=2.922, 100=2.3941, 500=2.03808, 1000=1.71886 (USD); Mount: Surface Mount; Case/Package: TSSOP; Number of Pins: 8; Min Operating Temperature: -40°C; Max Operating Temperature: 125°C; Package Quantity: 1; Packaging: Tape and Reel; Max Input Voltage: 5.5V; Min Input Voltage: 300mV; Radiation Hardening: No; Lead Free: Lead Free; ComponentLink1URL: http://www.st.com/content/ccc/resource/sales_and_marketing/presentation/product_presentation/1c/30/c4/86/3e/5b/42/bb/spv1040solarbatterycharger.pdf/files/spv1040solarbatterycharger.pdf/jcr:content/translations/en.spv1040solarbatterycharger.pdf?src-supplier=Digi-Key; ComponentLink1Description: http://www.st.com/content/ccc/resource/sales_and_marketing/presentation/product_presentation/1c/30/c4/86/3e/5b/42/bb/spv1040solarbatterycharger.pdf/files/spv1040solarbatterycharger.pdf/jcr:content/translations/en.spv1040solarbatterycharger.pdf?src-supplier=Digi-Key; ComponentLink2URL: http://www.mouser.com/ds/2/389/spv1040-974182.pdf?src-supplier=Mouser; ComponentLink2Description: http://www.mouser.com/ds/2/389/spv1040-974182.pdf?src-supplier=Mouser; ComponentLink3URL: http://www.st.com/web/en/resource/technical/document/datasheet/CD00287506.pdf?src-supplier=Avnet+Europe; ComponentLink3Description: http://www.st.com/web/en/resource/technical/document/datasheet/CD00287506.pdf?src-supplier=Avnet+Europe; ComponentLink4URL: http://www.st.com/st-web-ui/static/active/en/resource/technical/document/datasheet/CD00287506.pdf?src-supplier=Future+Electronics; ComponentLink4Description: http://www.st.com/st-web-ui/static/active/en/resource/technical/document/datasheet/CD00287506.pdf?src-supplier=Future+Electronics; ComponentLink5URL: http://www.produktinfo.conrad.com/datenblaetter/1100000-1199999/001184458-da-01-en-IC_SOLAR_BATTERY_SPV1040TTR_TSSOP_8_STM.pdf?src-supplier=Conrad; ComponentLink5Description: http://www.produktinfo.conrad.com/datenblaetter/1100000-1199999/001184458-da-01-en-IC_SOLAR_BATTERY_SPV1040TTR_TSSOP_8_STM.pdf?src-supplier=Conrad; Supplier Part Number 1: 497-11288-1-ND
U3 = LTC4352IMS#PBF: IC OR CTRLR N+1 12MSOP; Manufacturer: Analog Devices / Linear Technology; Min Supply Voltage: 2.9V; Max Supply Voltage: 18V; Number of Outputs: 1; Max Output Current: 1.5A; Turn-On Delay Time: 250ns; Turn-Off Delay Time: 500ns; Supplier 1: Digi-Key; Manufacturer Part Number: LTC4352IMS#PBF; Stock 1: 3058; Pricing 1: 1 = 7.04000, 25 = 4.67320, 100 = 3.86400, 250 = 3.67080, 500 = 3.58800 (USD); RoHS: Yes; Case/Package: MSOP; Number of Pins: 12; Min Operating Temperature: -40°C; Max Operating Temperature: 85°C; Package Quantity: 37; Number of Drivers: 1; Length: 4.04mm; Height: 0.86mm; Width: 3mm; Radiation Hardening: No; REACH SVHC: No SVHC; ComponentLink1URL: https://datasheet.ciiva.com/30476/0900766b812525cc-30476828.pdf?src-supplier=RSComponents; ComponentLink1Description: https://datasheet.ciiva.com/30476/0900766b812525cc-30476828.pdf?src-supplier=RSComponents; ComponentLink2URL: https://datasheet.ciiva.com/15110/getdatasheetpartid-364841-15110223.pdf?src-supplier=Verical; ComponentLink2Description: https://datasheet.ciiva.com/15110/getdatasheetpartid-364841-15110223.pdf?src-supplier=Verical; ComponentLink3URL: https://datasheet.ciiva.com/26881/ltc4352ims-pbf-26881361.pdf?src-supplier=IIIC; ComponentLink3Description: https://datasheet.ciiva.com/26881/ltc4352ims-pbf-26881361.pdf?src-supplier=IIIC; ComponentLink4URL: https://datasheet.ciiva.com/1511/1692585-1511380.pdf?src-supplier=Element14; ComponentLink4Description: https://datasheet.ciiva.com/1511/1692585-1511380.pdf?src-supplier=Element14; ComponentLink5URL: https://datasheet.ciiva.com/1960/26584-1960776.pdf?src-supplier=Digi-Key; ComponentLink5Description: https://datasheet.ciiva.com/1960/26584-1960776.pdf?src-supplier=Digi-Key; ComponentLink6URL: https://datasheet.ciiva.com/1569/1692585-1569135.pdf?src-supplier=Farnell; ComponentLink6Description: https://datasheet.ciiva.com/1569/1692585-1569135.pdf?src-supplier=Farnell; Supplier Part Number 1: LTC4352IMS#PBF-ND